# Altium schematic sheet CAN.SchDoc: Localization
size Letter; DrawnBy: Alaina Hansen, Cindy Li; Organization: Altium Limited; Address1: L3, 12a Rodborough Rd; Address2: Frenchs Forest; Address3: NSW; Address4: Australia 2086; SheetNumber: 7; SheetTotal: 7
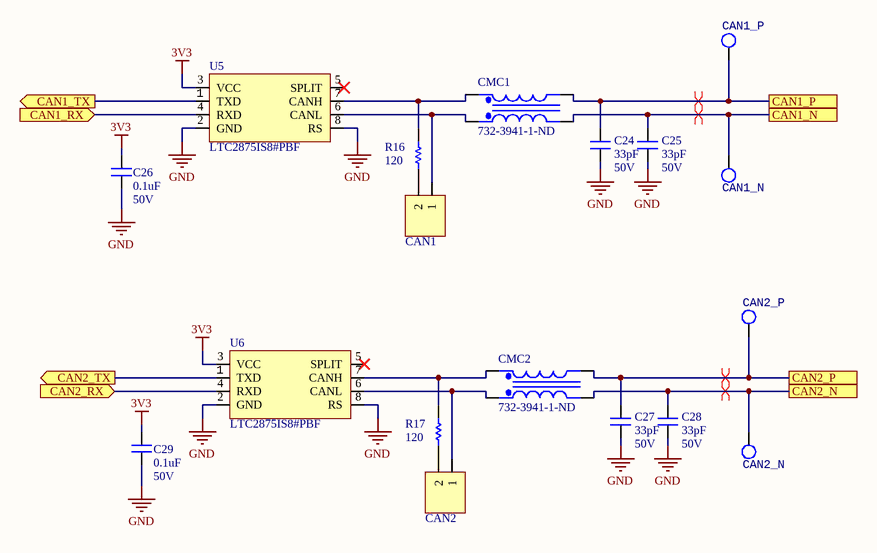
[diagram p0: CAN.SchDoc]

## Parts
C24  Voltage: 50V  Capacitance: 33pF  [CAPC0603(1608)55_N]  (hidden comment: CAP_33pF_50V_0603)
C25  Voltage: 50V  Capacitance: 33pF  [CAPC0603(1608)55_N]  (hidden comment: CAP_33pF_50V_0603)
C26  value 0.1uF  Voltage Rating: 50V  [CAPC2012X140N]  (hidden comment: CAP_0.1uF_50V_0805)
C27  Voltage: 50V  Capacitance: 33pF  [CAPC0603(1608)55_N]  (hidden comment: CAP_33pF_50V_0603)
C28  Voltage: 50V  Capacitance: 33pF  [CAPC0603(1608)55_N]  (hidden comment: CAP_33pF_50V_0603)
C29  value 0.1uF  Voltage Rating: 50V  [CAPC2012X140N]  (hidden comment: CAP_0.1uF_50V_0805)
CAN1  JUMPER_2  [HDR1X2]  (value not drawn)
CAN1_N  TESTPOINT_LOOP  [TESTPOINT_LOOP]  (value not drawn)
CAN1_P  TESTPOINT_LOOP  [TESTPOINT_LOOP]  (value not drawn)
CAN2  JUMPER_2  [HDR1X2]  (value not drawn)
CAN2_N  TESTPOINT_LOOP  [TESTPOINT_LOOP]  (value not drawn)
CAN2_P  TESTPOINT_LOOP  [TESTPOINT_LOOP]  (value not drawn)
CMC1  Supplier Part Number 1: 732-3941-1-ND  [744212510]  (hidden comment: CMC_51uH)
CMC2  Supplier Part Number 1: 732-3941-1-ND  [744212510]  (hidden comment: CMC_51uH)
R16  value 120  [RESC0603(1608)_N]  (hidden comment: RES_120R_0603)
R17  value 120  [RESC0603(1608)_N]  (hidden comment: RES_120R_0603)
U5  Manufacturer Part Number 1: LTC2875IS8#PBF  [LT-S8_N]  (hidden comment: IC TXRX CAN)
U6  Manufacturer Part Number 1: LTC2875IS8#PBF  [LT-S8_N]  (hidden comment: IC TXRX CAN)

## Ports
CAN1_N, CAN1_P, CAN1_RX (in), CAN1_TX (out), CAN2_N, CAN2_P, CAN2_RX (in), CAN2_TX (out)

## Nets
3V3: C26.2 C29.2 U5.3(VCC) U6.3(VCC)
GND: C24.1 C25.1 C26.1 C27.1 C28.1 C29.1 U5.2(GND) U5.8(RS) U6.2(GND) U6.8(RS)
CAN1_N: C25.2 CAN1_N.1 CMC1.5(Pri-) ; port CAN1_N
CAN1_P: C24.2 CAN1_P.1 CMC1.4(Sec-) ; port CAN1_P
CAN1_RX: U5.4(RXD) ; port CAN1_RX
CAN1_TX: U5.1(TXD) ; port CAN1_TX
CAN2_N: C28.2 CAN2_N.1 CMC2.5(Pri-) ; port CAN2_N
CAN2_P: C27.2 CAN2_P.1 CMC2.4(Sec-) ; port CAN2_P
CAN2_RX: U6.4(RXD) ; port CAN2_RX
CAN2_TX: U6.1(TXD) ; port CAN2_TX
NetCAN1_1: CAN1.1 CMC1.1(Pri+) U5.6(CANL)
NetCAN1_2: CAN1.2 R16.2
NetCAN2_1: CAN2.1 CMC2.1(Pri+) U6.6(CANL)
NetCAN2_2: CAN2.2 R17.2
NetCMC1_3: CMC1.3(Sec+) R16.1 U5.7(CANH)
NetCMC2_3: CMC2.3(Sec+) R17.1 U6.7(CANH)

Not connected (* = marked no-connect by the designer): U5 5(SPLIT)*; U6 5(SPLIT)*

## Layout directives
differential pair: CAN1_N, CAN1_P, CAN2_N, CAN2_P

## Notes on the sheet
- Title
- Size:
- Date:
- Letter
- Drawn By:
- Sheet
- of
- File:

## Library data of the parts
C24 C25 C27 C28 = CAP_33pF_50V_0603: CAP CER 33PF 50V C0G/NP0; Manufacturer 1: Yageo; Manufacturer Part Number 1: CC0603JRNPO9BN330; Dielectric Material: Ceramic; Temperature Coefficient: 30ppm/°C; Tolerance: 5%; Dielectric: C0G; Insulation Resistance: 100GR; Supplier 1: Digi-Key; Stock 1: 177901; Pricing 1: 1=0.10000, 10=0.04900, 100=0.02190, 500=0.01566, 1000=0.01231 (USD); RoHS: Yes; Mount: Surface Mount; Case/Package: 0603; Number of Pins: 2; Case Code (Metric): 1608; Case Code (Imperial): 0603; Min Operating Temperature: -55°C; Max Operating Temperature: 125°C; Termination: SMD/SMT; Composition: Ceramic; Packaging: Tape and Reel; Voltage Rating: 50V; Package Quantity: 1; Voltage Rating (DC): 50V; Length: 1.6mm; Height: 0.8mm; Thickness: 0.035inch; Depth: 0.8mm; Width: 0.031inch; Radiation Hardening: No; Lead Free: Lead Free; REACH SVHC: No SVHC; ComponentLink1URL: https://datasheet.ciiva.com/11786/0900766b8079c870-11786082.pdf?src-supplier=RSComponents; ComponentLink1Description: https://datasheet.ciiva.com/11786/0900766b8079c870-11786082.pdf?src-supplier=RSComponents; ComponentLink2URL: https://datasheet.ciiva.com/26862/getdatasheetpartid-403532-26862767.pdf?src-supplier=Verical; ComponentLink2Description: https://datasheet.ciiva.com/26862/getdatasheetpartid-403532-26862767.pdf?src-supplier=Verical; ComponentLink3URL: https://datasheet.ciiva.com/144/mlccorderingcode-144643.pdf?src-supplier=Digi-Key; ComponentLink3Description: https://datasheet.ciiva.com/144/mlccorderingcode-144643.pdf?src-supplier=Digi-Key; ComponentLink4URL: https://datasheet.ciiva.com/144/mlccorderingcode-144645.pdf?src-supplier=Digi-Key; ComponentLink4Description: https://datasheet.ciiva.com/144/mlccorderingcode-144645.pdf?src-supplier=Digi-Key; ComponentLink5URL: https://datasheet.ciiva.com/8033/1372269-8033734.pdf?src-supplier=Element14; ComponentLink5Description: https://datasheet.ciiva.com/8033/1372269-8033734.pdf?src-supplier=Element14; ComponentLink6URL: https://datasheet.ciiva.com/8033/1443161-8033735.pdf?src-supplier=Element14; ComponentLink6Description: https://datasheet.ciiva.com/8033/1443161-8033735.pdf?src-supplier=Element14; ComponentLink7URL: https://datasheet.ciiva.com/11464/upy-gp-np0-16v-to-50v-8-11464730.pdf?src-supplier=Avnet; ComponentLink7Description: https://datasheet.ciiva.com/11464/upy-gp-np0-16v-to-50v-8-11464730.pdf?src-supplier=Avnet; ComponentLink8URL: https://datasheet.ciiva.com/46430/1835847-46430155.pdf?src-supplier=Element14; ComponentLink8Description: https://datasheet.ciiva.com/46430/1835847-46430155.pdf?src-supplier=Element14; ComponentLink9URL: https://datasheet.ciiva.com/144/mlccorderingcode-144644.pdf?src-supplier=Digi-Key; ComponentLink9Description: https://datasheet.ciiva.com/144/mlccorderingcode-144644.pdf?src-supplier=Digi-Key; ComponentLink10URL: https://datasheet.ciiva.com/5426/upy-gp-np0-16v-to-50v-8-5426614.pdf?src-supplier=Mouser; ComponentLink10Description: https://datasheet.ciiva.com/5426/upy-gp-np0-16v-to-50v-8-5426614.pdf?src-supplier=Mouser; ComponentLink11URL: https://datasheet.ciiva.com/7978/1443161-7978142.pdf?src-supplier=Element14; ComponentLink11Description: https://datasheet.ciiva.com/7978/1443161-7978142.pdf?src-supplier=Element14; Supplier Part Number 1: 311-1064-1-ND
C26 C29 = CAP_0.1uF_50V_0805: CAP CER 0.1UF 50V X7R 0805; Manufacturer 1: Murata Electronics; Manufacturer Part Number 1: GCD21BR71H104KA01L; Capacitance: 100nF; Tolerance: 10%; Mount: Surface Mount; Case/Package: 0805; Case Code (Metric): 2012; Case Code (Imperial): 0805; Min Operating Temperature: -55°C; Max Operating Temperature: 125°C; Dielectric: X7R; Termination: SMD/SMT; Length: 2mm; Height: 1.25mm; Width: 0.049inch; Thickness: 0.049inch; Depth: 1.25mm; Ratings: AEC-Q200; ComponentLink1URL: https://datasheet.ciiva.com/29537/c03e-29537701.pdf?src-supplier=Digi-Key; ComponentLink1Description: https://datasheet.ciiva.com/29537/c03e-29537701.pdf?src-supplier=Digi-Key; Supplier 1: Digi-Key; Supplier Part Number 1: 490-11955-1-ND
CAN1 CAN2 = JUMPER_2: HEADER 2X1; Manufacturer 1: TE Connectivity; Manufacturer Part Number 1: 87220-2; Supplier 1: Digi-Key; Supplier Part Number 1: A26542-ND; Mount: Through Hole
CAN1_N CAN1_P CAN2_N CAN2_P = TESTPOINT_LOOP: Loop testpoint through-hole pad; Manufacturer Part Number 1: 5002; Manufacturer 1: Keystone Electronics; Supplier Part Number 1: 36-5002-ND; Supplier 1: Digi-Key; Mount: Through Hole
CMC1 CMC2 = CMC_51uH: CMC 51uH 300MA 2LN SMD; Manufacturer 1: Wurth Electronics; Core Material: Ferrite; DC Resistance (DCR): 160mR; Test Frequency: 100kHz; Inductance Tolerance: 50%; Voltage Rating (DC): 80V; Number of Lines: 2; Impedance: 300R; Supplier 1: Digi-Key; Manufacturer Part Number 1: 744212510; Stock 1: 1070; Pricing 1: 1=4.22000, 10=4.16600, 50=3.76300, 100=3.62900, 500=3.36000 (USD); RoHS: Yes; Mount: Surface Mount; Case/Package: SMD/SMT; Number of Pins: 4; Min Operating Temperature: -40°C; Max Operating Temperature: 105°C; Current: 300mA; Max DC Current: 300mA; Termination: SMD/SMT; Current Rating: 300mA; Inductance: 51uH; Tolerance: 50%; Package Quantity: 1000; Packaging: Tape and Reel; Length: 6.5mm; Height: 1.65mm; Depth: 3.6mm; Width: 0.142inch; REACH SVHC: No SVHC; Lead Free: Lead Free; ComponentLink1URL: https://datasheet.ciiva.com/11800/0900766b8059564e-11800467.pdf?src-supplier=RSComponents; ComponentLink1Description: https://datasheet.ciiva.com/11800/0900766b8059564e-11800467.pdf?src-supplier=RSComponents; ComponentLink2URL: https://datasheet.ciiva.com/1130/744212510-1130407.pdf?src-supplier=Newark; ComponentLink2Description: https://datasheet.ciiva.com/1130/744212510-1130407.pdf?src-supplier=Newark; ComponentLink3URL: https://datasheet.ciiva.com/6048/1735560-6048484.pdf?src-supplier=Farnell; ComponentLink3Description: https://datasheet.ciiva.com/6048/1735560-6048484.pdf?src-supplier=Farnell; ComponentLink4URL: https://datasheet.ciiva.com/4952/744212510-77598-4952687.pdf?src-supplier=Mouser; ComponentLink4Description: https://datasheet.ciiva.com/4952/744212510-77598-4952687.pdf?src-supplier=Mouser; ComponentLink5URL: https://datasheet.ciiva.com/6216/744212510-6216346.pdf?src-supplier=Digi-Key; ComponentLink5Description: https://datasheet.ciiva.com/6216/744212510-6216346.pdf?src-supplier=Digi-Key; ComponentLink6URL: https://datasheet.ciiva.com/22705/1735560-22705131.pdf?src-supplier=Element14; ComponentLink6Description: https://datasheet.ciiva.com/22705/1735560-22705131.pdf?src-supplier=Element14; ComponentLink7URL: https://datasheet.ciiva.com/6216/744212510-6216348.pdf?src-supplier=Digi-Key; ComponentLink7Description: https://datasheet.ciiva.com/6216/744212510-6216348.pdf?src-supplier=Digi-Key; ComponentLink8URL: https://datasheet.ciiva.com/7764/1735560-7764951.pdf?src-supplier=Element14; ComponentLink8Description: https://datasheet.ciiva.com/7764/1735560-7764951.pdf?src-supplier=Element14
R16 R17 = RES_120R_0603: RES SMD 120 OHM 5% 1/10W 0603; Manufacturer 1: Yageo; Manufacturer Part Number 1: RC0603JR-07120RL; Package: 0603 (1608 Metric); Dimensions: 0.063" L x 0.031" W (1.60mm x 0.80mm); Tolerance: 5%; Supplier Part Number 1: 311-120GRCT-ND; Supplier 1: Digi-Key; Mount: Surface Mount
U5 U6 = LTC2875: IC TXRX CAN 4MBPS 8SO; Manufacturer 1: Linear Technologies; Package: 8-SOIC (0.154", 3.90mm Width); ComponentLink1Description: Datasheet; ComponentLink1URL: https://www.analog.com/media/en/technical-documentation/data-sheets/2875f.pdf; Supplier Part Number 1: LTC2875IS8#PBF-ND; Supplier 1: Digi-Key; Mount: Surface Mount